# EAGLE design tt-i2c-v3 (EAGLE 9.4.2)

## Sheet 1 of 2
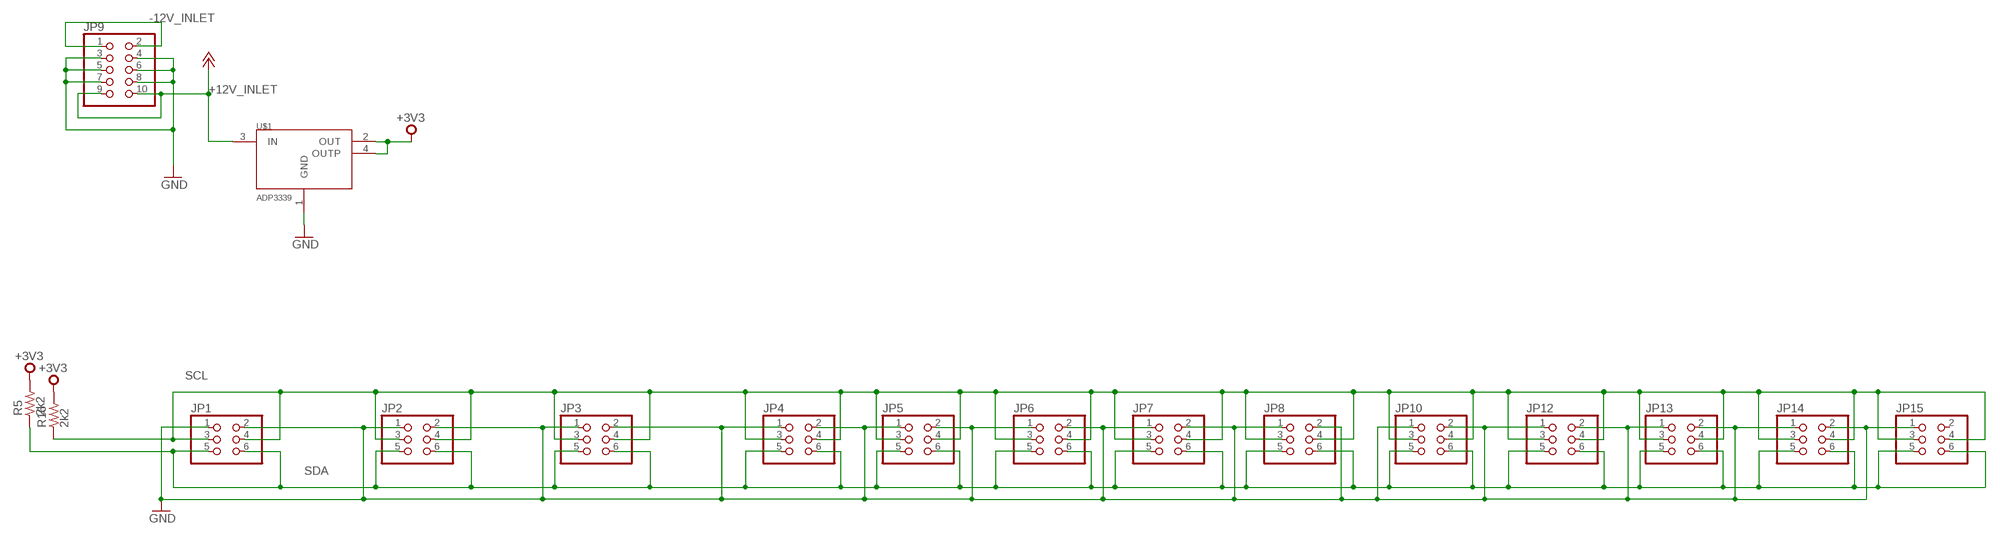
[diagram p0: schematic, sheet 1]

### Parts
JP1  PINHD-2X3  [2X03]
JP2  PINHD-2X3  [2X03]
JP3  PINHD-2X3  [2X03]
JP4  PINHD-2X3  [2X03]
JP5  PINHD-2X3  [2X03]
JP6  PINHD-2X3  [2X03]
JP7  PINHD-2X3  [2X03]
JP8  PINHD-2X3  [2X03]
JP9  PINHD-2X5  [2X05]
JP10  PINHD-2X3  [2X03]
JP12  PINHD-2X3  [2X03]
JP13  PINHD-2X3  [2X03]
JP14  PINHD-2X3  [2X03]
JP15  PINHD-2X3  [2X03]
R5  2k2  R_1206  [R1206]
R16  2k2  R_1206  [R1206]
U$1  ADP3339  [SOT223]

### Nets
+3V3: R5.2 R16.2 U$1.2(OUT) U$1.4(OUTP) ; also sheet 2
+12V_INLET [power]: JP9.9 JP9.10 U$1.3(IN) ; supply symbol labelled +12V ; also sheet 2
-12V_INLET [power]: JP9.1 JP9.2 ; also sheet 2
GND: JP1.1 JP1.2 JP2.1 JP2.2 JP3.1 JP3.2 JP4.1 JP4.2 JP5.1 JP5.2 JP6.1 JP6.2 JP7.1 JP7.2 JP8.1 JP8.2 JP9.3 JP9.4 JP9.5 JP9.6 JP9.7 JP9.8 JP10.1 JP10.2 JP12.1 JP12.2 JP13.1 JP13.2 JP14.1 JP14.2 JP15.1 U$1.1(GND) ; also sheet 2
SCL: JP1.3 JP1.4 JP2.3 JP2.4 JP3.3 JP3.4 JP4.3 JP4.4 JP5.3 JP5.4 JP6.3 JP6.4 JP7.3 JP7.4 JP8.3 JP8.4 JP10.3 JP10.4 JP12.3 JP12.4 JP13.3 JP13.4 JP14.3 JP14.4 JP15.3 JP15.4 R16.1 ; also sheet 2
SDA: JP1.5 JP1.6 JP2.5 JP2.6 JP3.5 JP3.6 JP4.5 JP4.6 JP5.5 JP5.6 JP6.5 JP6.6 JP7.5 JP7.6 JP8.5 JP8.6 JP10.5 JP10.6 JP12.5 JP12.6 JP13.5 JP13.6 JP14.5 JP14.6 JP15.5 JP15.6 R5.1 ; also sheet 2
Unconnected: JP15.2

## Sheet 2 of 2
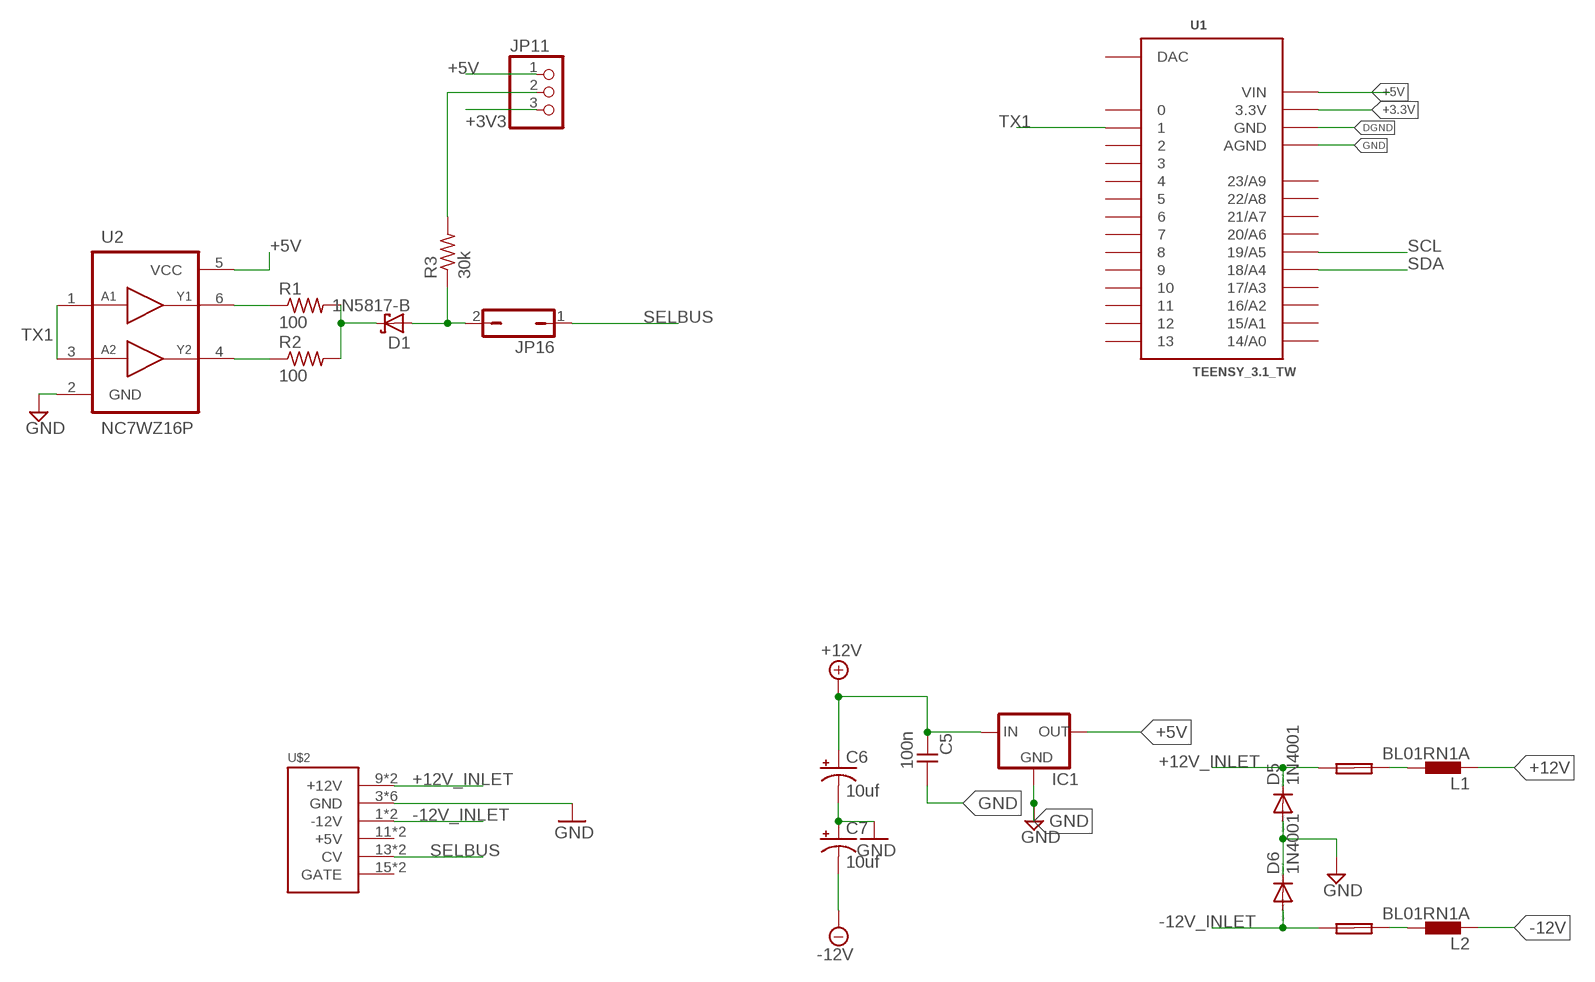
[diagram p1: schematic, sheet 2]

### Parts
C5  100n  C-EU050-024X044  [C050-024X044]
C6  10uf  CAP_POLPTH2  [CPOL-RADIAL-10UF-25V]
C7  10uf  CAP_POLPTH2  [CPOL-RADIAL-10UF-25V]
D1  1N5817-B  [DO41-7.6]
D5  1N4001  1N4004  [DO41-10]
D6  1N4001  1N4004  [DO41-10]
F1  FUSE  PTC_FUSEPOLY_FUSE  [C050H075X075]
F2  FUSE  PTC_FUSEPOLY_FUSE  [C050H075X075]
IC1  78LXX  [78LXX]
JP11  PINHD-1X3  [1X03]
JP16  JP1Q  [JP1]
L1  BL01RN1A  [BL01RN1A]
L2  BL01RN1A  [BL01RN1A]
R1  100  R-US_0207/7  [0207/7]
R2  100  R-US_0207/7  [0207/7]
R3  30k  R-US_0207/7  [0207/7]
U1  TEENSY_3.1_TW  [TEENSY_3.1_TW]
U2  NC7WZ16P  [SC70-6]
U$2  POWER  [POWER_16]

### Nets
+3.3V: U1.3.3V
+3V3: JP11.3 ; also sheet 1
+5V: IC1.OUT JP11.1 U1.VIN U2.5(VCC)
+12V: C5.2 C6.1(+) IC1.IN L1.1
+12V_INLET [power]: D5.C F1.1 U$2.9(+12V) U$2.10(+12V) ; also sheet 1
-12V [power]: C7.2(-) L2.1
-12V_INLET [power]: D6.A F2.1 U$2.1(-12V) U$2.2(-12V) ; also sheet 1
DGND: U1.GND
GND: C5.1 C6.2(-) C7.1(+) D5.A D6.C IC1.GND U1.AGND U2.2(GND) U$2.3(GND) U$2.4(GND) U$2.5(GND) U$2.6(GND) U$2.7(GND) U$2.8(GND) ; also sheet 1
N$1: R1.1 U2.6(Y1)
N$2: R2.1 U2.4(Y2)
N$3: D1.C R1.2 R2.2
N$6: JP11.2 R3.2
N$7: D1.A JP16.2 R3.1
N$22 [power]: F1.2 L1.2
N$23 [power]: F2.2 L2.2
SCL: U1.19/A5 ; also sheet 1
SDA: U1.18/A4 ; also sheet 1
SELBUS: JP16.1 U$2.13(CV) U$2.14(CV)
TX1: U1.1 U2.1(A1) U2.3(A2)
Unconnected: U1.0 U1.2 U1.3 U1.4 U1.5 U1.6 U1.7 U1.8 U1.9 U1.10 U1.11 U1.12 U1.13 U1.14/A0 U1.15/A1 U1.16/A2 U1.17/A3 U1.20/A6 U1.21/A7 U1.22/A8 U1.23/A9 U1.DAC U$2.11(+5V) U$2.12(+5V) U$2.15(GATE) U$2.16(GATE)

## Library data of the parts
C5 = TomW:C-EU: CAPACITOR, European symbol
C6 C7 = SparkFun-Passives:CAP_POL: Capacitor Polarized These are standard SMD and PTH capacitors. Normally 10uF, 47uF, and 100uF in electrolytic and tantalum varieties. Always verify the external diameter of the through hole cap, it varies with capacity, voltage, and manufacturer. The EIA devices should be standard.
D1 = diode:1N581*: 1.0A SCHOTTKY BARRIER RECTIFIER Source: http://www.diodes.com/datasheets/ds23001.pdf
D5 D6 = diode:1N4004: DIODE general purpose rectifier, 1 A
F1 F2 = TomW:PTC_FUSE
IC1 = v-reg:78LXX: VOLTAGE REGULATOR
JP1-JP8 JP10 JP12-JP15 = pinhead:PINHD-2X3: PIN HEADER
JP9 = pinhead:PINHD-2X5: PIN HEADER
JP11 = pinhead:PINHD-1X3: PIN HEADER
JP16 = jumper:JP1Q: JUMPER
L1 L2 = inductors:BL0: Noise Suppression Products/EMI Suppression Filters, Lead EMIFIL(R) Inductor Type Source: http://www.murata.com .. BL01RN1_DS.pdf
R1-R3 = resistor:R-US_: RESISTOR, American symbol
R5 R16 = rc-master-smd:R_: RESISTOR
U1 = TomW:TEENSY_3.1_TW: Basic Teensy 3.0 with none of the 'inner' pins enabled. See '+4', 'AllAnalogPins", and 'AllPins' packages for additional pin holes, as needed.
U2 = fairchild-semi:NC7WZ16P: UHS Dual Buffer
U$1 = monome-inc:ADP3339
U$2 = eurorack:POWER

## Net classes
0 default: width 0.203 mm
1 power: width 0.305 mm
2 ground: width 0.305 mm

## Board
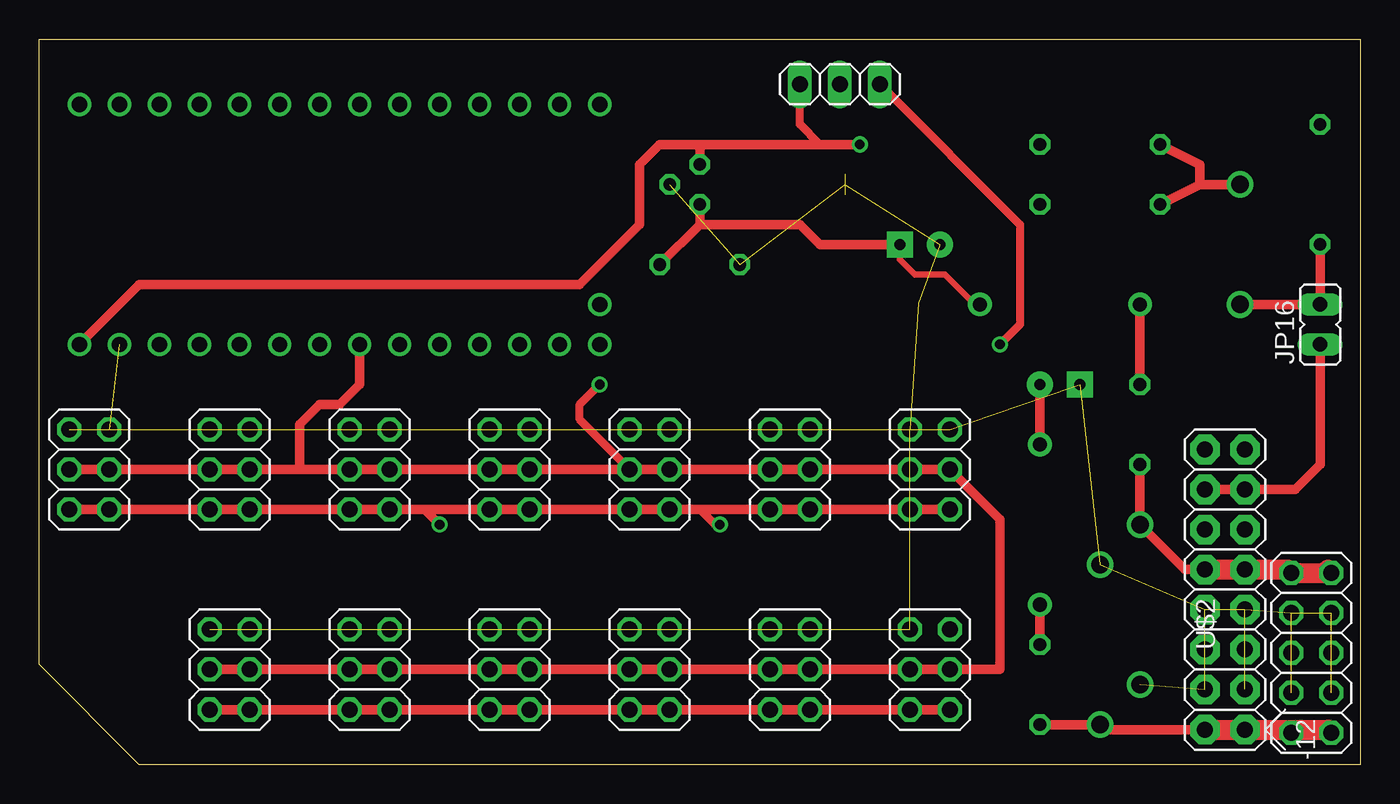
[diagram p2: board, top side]
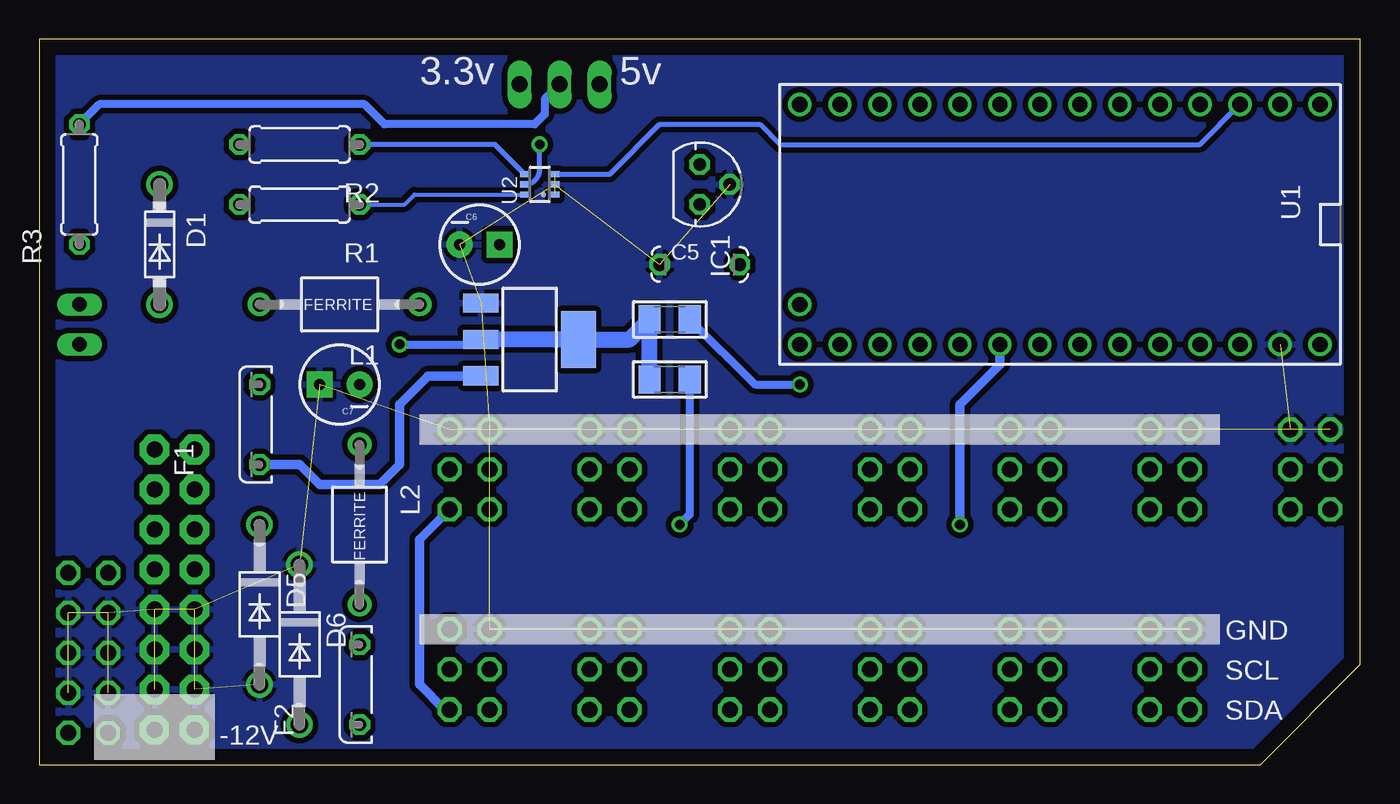
[diagram p3: board, bottom side, seen from below]

Size 83.82 x 46.04 mm. Coordinates in mm from the lower left corner, seen from the top.
Outline: 0,46.04 83.82,46.04 83.82,0 6.35,0 0,6.35 0,46.04
Copper layers (1*16): Top 0.035mm / dielectric 1.5mm / Bottom 0.035mm
Design rules "default": minimum track width 10mil, minimum drill 24mil, track to track 8mil, track to pad 8mil, pad to pad 8mil, via to via 8mil, smd to smd 8mil, copper to edge 40mil, drill to drill 8mil, minimum pad ring 10mil, minimum via ring 8mil, stop-mask expansion 4mil, vias tented up to drill 0mil, thermal gap 10mil

### Footprints (pad centres in the part's own frame; a part is rotated, then mirrored left to right if it is on the bottom)
C050-024X044 = drill 0.813 octagon: 1 -2.54,0; 2 2.54,0
CPOL-RADIAL-10UF-25V = drill 0.7 pad 1.651 square: 1 1.27,0 | drill 0.7 pad 1.651: 2 -1.27,0
DO41-7.6 = drill 1.1 pad 1.7: A 3.81,0; C -3.81,0
DO41-10 = drill 1.118: A 5.08,0; C -5.08,0
C050H075X075 = drill 0.813 octagon: 1 -2.54,0; 2 2.54,0
78LXX = drill 0.813 octagon: GND 0,1.905; IN 1.27,0; OUT -1.27,0
2X03 = drill 1.016 octagon: 1 -2.54,-1.27; 2 -2.54,1.27; 3 0,-1.27; 4 0,1.27; 5 2.54,-1.27; 6 2.54,1.27
2X05 = drill 1.016 octagon: 1 -5.08,-1.27; 2 -5.08,1.27; 3 -2.54,-1.27; 4 -2.54,1.27; 5 0,-1.27; 6 0,1.27; 7 2.54,-1.27; 8 2.54,1.27; 9 5.08,-1.27; 10 5.08,1.27
1X03 = drill 1.016 long: 1 -2.54,0; 2 0,0; 3 2.54,0
JP1 = drill 0.914 long: 1 0,-1.27; 2 0,1.27
BL01RN1A = drill 0.9 pad 1.5: 1 -5.08,0; 2 5.08,0
0207/7 = drill 0.813 octagon: 1 -3.81,0; 2 3.81,0
R1206 = smd 1.4 x 1.8: 1 -1.27,0; 2 1.27,0
TEENSY_3.1_TW = drill 0.965: 0 -7.62,13.97; 1 -7.62,11.43; 2 -7.62,8.89; 3 -7.62,6.35; 3.3V 7.62,11.43; 4 -7.62,3.81; 5 -7.62,1.27; 6 -7.62,-1.27; 7 -7.62,-3.81; 8 -7.62,-6.35; 9 -7.62,-8.89; 10 -7.62,-11.43; 11 -7.62,-13.97; 12 -7.62,-16.51; 13 7.62,-16.51; 14/A0 7.62,-13.97; 15/A1 7.62,-11.43; 16/A2 7.62,-8.89; 17/A3 7.62,-6.35; 18/A4 7.62,-3.81; 19/A5 7.62,-1.27; 20/A6 7.62,1.27; 21/A7 7.62,3.81; 22/A8 7.62,6.35; 23/A9 7.62,8.89; AGND 7.62,13.97; DAC 5.08,-16.51; GND -7.62,16.51; VIN 7.62,16.51
SC70-6 = smd 0.4 x 0.6: 1 -0.65,-0.95; 2 0,-0.95; 3 0.65,-0.95; 4 0.65,0.95; 5 0,0.95; 6 -0.65,0.95
SOT223 = smd 1.219 x 2.235: 1 -2.311,-3.099; 2 0,-3.099; 3 2.311,-3.099 | smd 3.6 x 2.2: 4 0,3.099
POWER_16 = drill 1.016 pad 1.88 octagon: 1 -6.35,-1.27; 2 -6.35,1.27; 3 -3.81,-1.27; 4 -3.81,1.27; 5 -1.27,-1.27; 6 -1.27,1.27; 7 1.27,-1.27; 8 1.27,1.27; 9 3.81,-1.27; 10 3.81,1.27; 11 6.35,-1.27; 12 6.35,1.27; 13 8.89,-1.27; 14 8.89,1.27; 15 11.43,-1.27; 16 11.43,1.27

### Placement (x,y rotation side)
C5  41.91,31.75 0 bottom
C6  55.88,33.02 0 bottom
C7  64.77,24.13 180 bottom
D1  76.2,33.02 270 bottom
D5  69.85,10.16 270 bottom
D6  67.31,7.62 270 bottom
F1  69.85,21.59 90 bottom
F2  63.5,5.08 90 bottom
IC1  41.91,36.83 270 bottom
JP1  3.17,18.73 270 top
JP2  20.95,18.73 270 top
JP3  29.84,18.73 270 top
JP4  38.73,18.73 270 top
JP5  12.06,6.03 270 top
JP6  20.95,6.03 270 top
JP7  29.84,6.03 270 top
JP8  38.73,6.03 270 top
JP9  80.72,7.1 90 top
JP10  12.06,18.73 270 top
JP11  50.8,43.18 0 top
JP12  47.62,18.73 270 top
JP13  47.62,6.03 270 top
JP14  56.52,18.73 270 top
JP15  56.52,6.03 270 top
JP16  81.28,27.94 0 top
L1  64.77,29.21 180 bottom
L2  63.5,15.24 270 bottom
R1  67.31,35.56 180 bottom
R2  67.31,39.37 180 bottom
R3  81.28,36.83 90 bottom
R5  43.81,24.45 180 bottom
R16  43.81,28.26 180 bottom
U1  19.05,34.29 270 bottom
U2  52.07,36.83 90 bottom
U$1  52.7,26.99 270 bottom
U$2  75.25,8.57 90 top

### Tracks (layer width: path | path; a pad name or v marks a point on that pad's centre or on a via)
+3V3  (via drill 0.61)
  Top 0.508: JP11.3 62.23,34.29 62.23,27.94 v60.96,26.67
  Bottom 0.508: v60.96,26.67 55.88,26.67 55.88,26.91 U$1.2
  Bottom 1.016: U$1.2 U$1.4 46.35,26.99 R16.2 R5.2
+5V  (via drill 0.61)
  Top 0.508: 49.53,39.37 48.26,40.64 JP11.1
  Top 0.61: U1.VIN 6.35,30.48 34.29,30.48 38.1,34.29 38.1,38.1 39.37,39.37 41.91,39.37 | 41.91,39.37 IC1.OUT | v52.07,39.37 49.53,39.37 41.91,39.37
  Bottom 0.305: U2.5 arc-90 52.07,37.78 v52.07,39.37
+12V
  Top 0.406: L1.1 59.37,29.21 57.47,31.11 55.56,31.11 54.61,32.07 C6.1
  Top 0.61: C5.2 41.91,34.29 | 41.91,34.29 48.26,34.29 49.53,33.02 C6.1 | 41.91,34.29 IC1.IN
+12V_INLET
  Top 0.61: U$2.10 72.71,12.38 D5.C F1.1
  Top 1.27: JP9.9 81.79,12.38 81.58,12.18 JP9.10 79.25,12.38 U$2.9 U$2.10
  Bottom 0.61: F1.1 67.31,19.05 66.04,17.78 62.23,17.78 60.96,19.05 60.96,22.86 59.14,24.68 U$1.3
-12V
  Top 0.61: L2.1 C7.2
-12V_INLET
  Top 0.61: JP9.2 JP9.1 | U$2.2 67.63,2.22 D6.A F2.1
  Top 1.27: U$2.2 U$2.1 81.79,2.22 JP9.1
GND  (45 unrouted)
  pour Bottom (isolate 0.35): 0,0 0,46.04 83.82,46.04 83.82,0
N$1
  Bottom 0.254: R1.1 60.64,35.56 60.01,36.2 53.03,36.2 U2.6
N$2
  Bottom 0.305: U2.4 54.91,39.37 R2.1
N$3
  Top 0.61: 73.66,36.83 D1.C | R1.2 73.66,36.83 | 73.66,36.83 73.66,38.1 R2.2
N$6
  Bottom 0.508: JP11.2 51.75,42.23 51.75,41.27 52.39,40.64 61.91,40.64 63.18,41.91 80.01,41.91 R3.2
N$7
  Top 0.61: D1.A JP16.2 R3.1
N$22
  Top 0.61: F1.2 L1.2
N$23
  Top 0.61: F2.2 L2.2
SCL  (via drill 0.61)
  Top 0.508: JP4.3 34.29,21.91 34.29,22.86 v35.56,24.13
  Top 0.61: JP1.4 JP1.3 JP10.4 JP10.3 16.51,18.73 | JP5.4 JP5.3 JP6.4 JP6.3 JP7.4 JP7.3 JP8.4 JP8.3 JP13.4 JP13.3 JP15.4 | JP15.4 JP15.3 | 16.51,18.73 JP2.4 JP2.3 JP3.4 JP3.3 JP4.4 JP4.3 JP12.4 JP12.3 JP14.4 | JP14.4 JP14.3 | JP14.4 60.96,15.56 60.96,6.03 JP15.4 | U1.19/A5 20.32,24.13 19.05,22.86 17.78,22.86 16.51,21.59 16.51,18.73
  Bottom 0.508: R16.1 38.42,24.13 v35.56,24.13
SDA  (via drill 0.61)
  Top 0.508: 41.91,16.19 42.86,15.24 v43.18,15.24
  Top 0.61: JP5.6 JP5.5 JP6.6 JP6.5 JP7.6 JP7.5 JP8.6 JP8.5 JP13.6 JP13.5 JP15.6 JP15.5 | 24.45,16.19 JP3.6 JP3.5 JP4.6 JP4.5 41.91,16.19 JP12.6 JP12.5 JP14.6 JP14.5 | JP1.6 JP1.5 JP10.6 JP10.5 JP2.6 JP2.5 24.13,16.19 24.45,16.19 | v25.4,15.24 24.45,16.19
  Bottom 0.508: R5.1 42.55,15.88 v43.18,15.24
  Bottom 0.61: JP15.6 58.1,3.49 59.69,5.08 59.69,14.29 JP14.6 | U1.18/A4 22.86,25.4 25.4,22.86 v25.4,15.24
SELBUS
  Top 0.61: JP16.1 81.28,19.05 79.69,17.46 U$2.13 U$2.14
TX1  (1 unrouted)
  Bottom 0.305: U2.3 47.61,37.48 44.45,40.64 38.1,40.64 36.83,39.37 10.16,39.37 U1.1

### Text on the board
bPlace: 5v | 3.3v | GND | SCL | SDA | -12V